# Altium schematic sheet BUCK.SchDoc
size A4; SheetNumber: 2; SheetTotal: 3
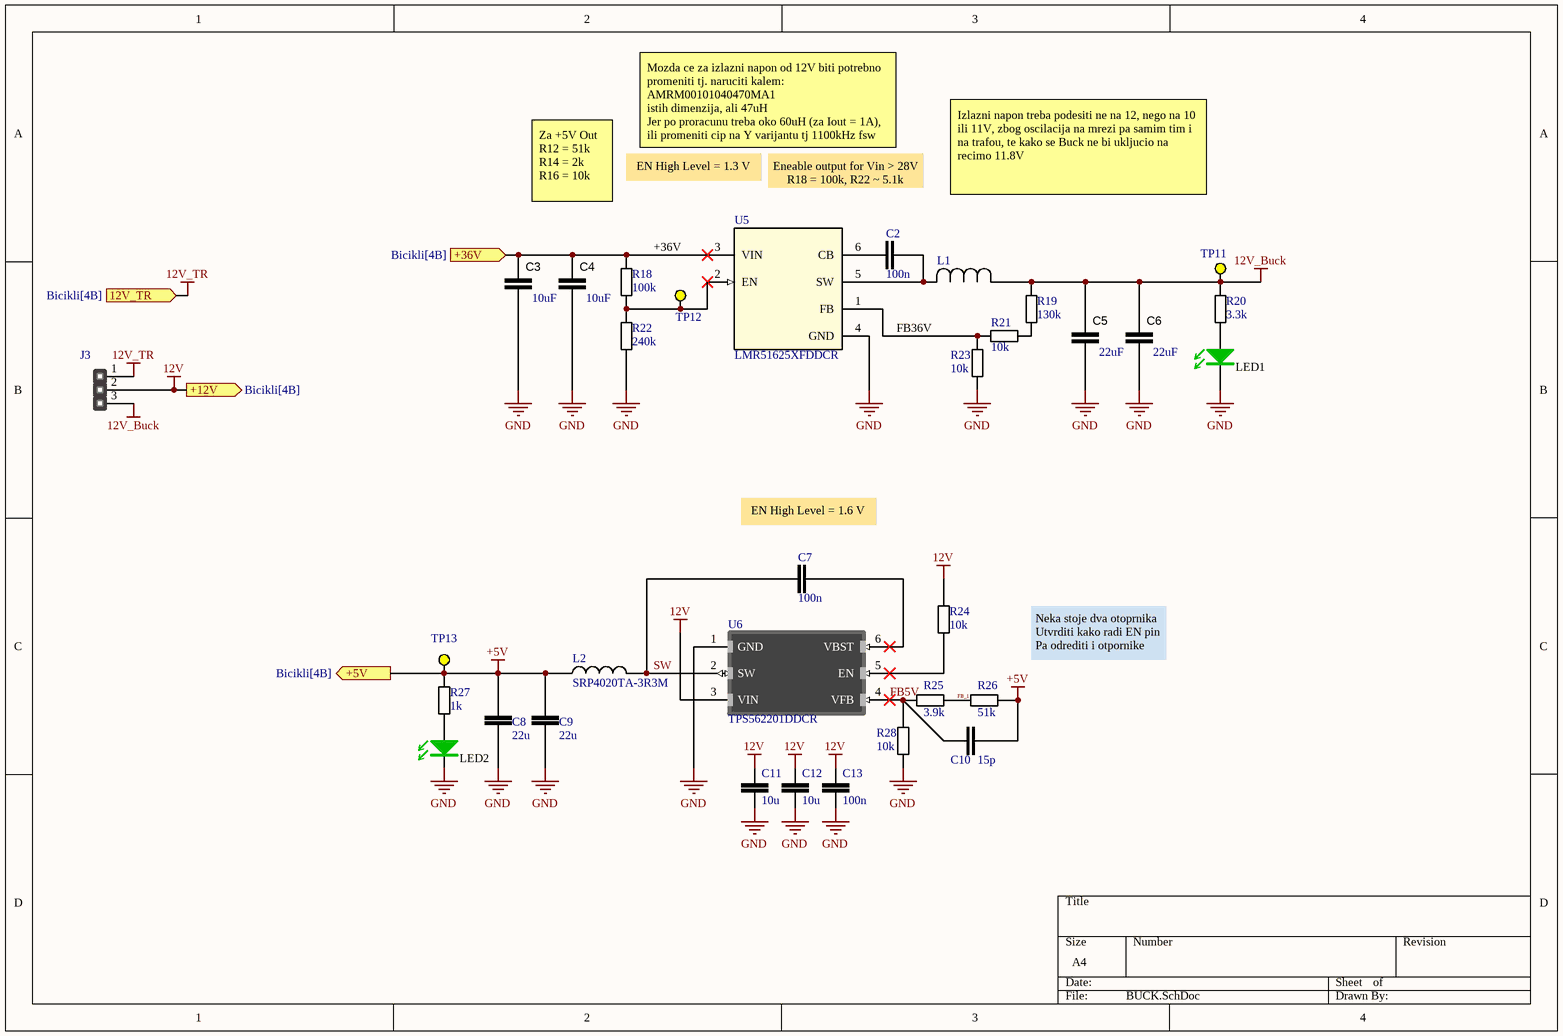
[diagram p0: BUCK.SchDoc]

## Parts
C2  100n  [CAP_0805]
C3  10uF  [CAP_1206]
C4  10uF  [CAP_1206]
C5  22uF  [CAP_1206]
C6  22uF  [CAP_1206]
C7  100n  [CAP_0805]
C8  22u  [CAP_0805]
C9  22u  [CAP_0805]
C10  15p  [CAP_0805]
C11  10u  [CAP_1206]
C12  10u  [CAP_1206]
C13  100n  [CAP_0805]
J3  3Pin  [HEADER3PIN]  (value not drawn)
L1  AMRM00101040100MA1  [IND_AMRM00101040_PUL]  (value not drawn)
L2  SRP4020TA-3R3M  [IND_SRP4020TA-3R3M]
LED1  LED GREEN  [LED_GREEN_0805]  (value not drawn)
LED2  LED GREEN  [LED_GREEN_0805]  (value not drawn)
R18  100k  [RESISTOR_0805_SMALLSILK]
R19  130k  [RESISTOR_0805_SMALLSILK]
R20  3.3k  [RESISTOR_0805_SMALLSILK]
R21  10k  [RESISTOR_0805_SMALLSILK]
R22  240k  [RESISTOR_0805_SMALLSILK]
R23  10k  [RESISTOR_0805_SMALLSILK]
R24  10k  [RESISTOR_0805_SMALLSILK]
R25  3.9k  [RESISTOR_0805_SMALLSILK]
R26  51k  [RESISTOR_0805_SMALLSILK]
R27  1k  [RESISTOR_0805_SMALLSILK]
R28  10k  [RESISTOR_0805_SMALLSILK]
TP11  TP  [TP]  (value not drawn)
TP12  TP  [TP]  (value not drawn)
TP13  TP  [TP]  (value not drawn)
U5  LMR51625XFDDCR  [DDC0006A-MFG]
U6  TPS562201DDCR  [SOT95P280X110-6N]

## Ports
12V_TR (in, see Bicikli[4B]), +5V (out, see Bicikli[4B]), +12V (out, see Bicikli[4B]), +36V (in, see Bicikli[4B])

## Nets
12V: C11.2 C12.2 C13.2 J3.2 R24.2 U6.3(VIN) ; port +12V
12V_Buck: C5.2 C6.2 J3.3 L1.1 R19.2 R20.2 TP11.1
12V_TR: J3.1 ; port 12V_TR
+5V: C8.2 C9.2 C10.2 L2.1 R26.2 R27.2 TP13.1 ; port +5V
GND: C3.1 C4.1 C5.1 C6.1 C8.1 C9.1 C11.1 C12.1 C13.1 LED1.1(C) LED2.1(C) R22.1 R23.1 R28.1 U5.4(GND) U6.1(GND)
+36V: C3.2 C4.2 R18.2 U5.3(VIN) ; port +36V
FB5V: C10.1 R25.1 R28.2 U6.4(VFB)
FB36V: R21.2 R23.2 U5.1(FB)
FB_1: R25.2 R26.1
SW: C7.1 L2.2 U6.2(SW)
NetC2_1: C2.1 U5.6(CB)
NetC2_2: C2.2 L1.2 U5.5(SW)
NetC7_2: C7.2 U6.6(VBST)
NetLED1_2: LED1.2(A) R20.1
NetLED2_2: LED2.2(A) R27.1
NetR18_1: R18.1 R22.2 TP12.1 U5.2(EN)
NetR19_1: R19.1 R21.1
NetR24_1: R24.1 U6.5(EN)

## Notes on the sheet
- EN High Level = 1.3 V
- Mozda ce za izlazni napon od 12V biti potrebno promeniti tj. naruciti kalem:
  AMRM00101040470MA1
  istih dimenzija, ali 47uH
  Jer po proracunu treba oko 60uH (za Iout = 1A), ili promeniti cip na Y varijantu tj 1100kHz fsw
- Za +5V Out
  R12 = 51k
  R14 = 2k
  R16 = 10k
- Eneable output for Vin > 28V
  R18 = 100k, R22 ~ 5.1k
- Izlazni napon treba podesiti ne na 12, nego na 10 ili 11V, zbog oscilacija na mrezi pa samim tim i na trafou, te kako se Buck ne bi ukljucio na recimo 11.8V
- EN High Level = 1.6 V
- (near R26) Neka stoje dva otoprnika
  Utvrditi kako radi EN pin
  Pa odrediti i otpornike

## Library data of the parts
C2 C7 C13 = C00079: CAP 100nF ±10% 50V 0805 X7R; capacitance: 100n
C3 C4 = C000020: 10 µF ±10% 50V Ceramic Capacitor X7R 1206 (3216 Metric); capacitance: 22uF; ComponentLink1Description: DigiKey; ComponentLink1URL: https://www.digikey.com/en/products/detail/samsung-electro-mechanics/CL31A226KAHNNNE/3888705; DigiKey Part Number: 1276-3047-1-ND
C5 C6 = C000020: 22 µF ±10% 25V Ceramic Capacitor X5R 1206 (3216 Metric); capacitance: 22uF; ComponentLink1Description: DigiKey; ComponentLink1URL: https://www.digikey.com/en/products/detail/samsung-electro-mechanics/CL31A226KAHNNNE/3888705; DigiKey Part Number: 1276-3047-1-ND
C8 C9 = C00086: CAP 22uF ±20% 10V 0805 X5R; capacitance: 22u
C10 = C00026: CAP 15pF ±5% 50V 0805 C0G; capacitance: 15p
C11 C12 = C00084: CAP 10uF ±10% 25V 0805 X5R; capacitance: 4.7u
J3 = HEADER3PIN: 3 PIN Male Header 2.54mm pitch
L1 = AMRM00101040100MA1: No Description Available; Manufacturer_Name: Pulse Electronics Corporation; Type: Fixed Inductors; Copyright: Copyright (C) 2025 Ultra Librarian. All rights reserved.; Manufacturer_Part_Number: AMRM00101040100MA1
L2 = SRP4020TA-3R3M: Surface Mount Power Inductor, AEC-Q200 SRP4020TA Series, 15 H, 20%, Shielded, 0.374 ohm, 1.5 A; MF: {'manufacturer': u'Bourns'}; Package: None; Price: None; Value: *; MP: SRP4020TA-3R3M; Availability: Unavailable
LED1 LED2 = LED_GREEN 0805: LED GREEN CLEAR 0805 SMD; Manufacturer: Kingbright; Manufacturer Part Number: APT2012SGC; Barcode: 2911010024338; id: 28; Voltage Forward: 2.2V; Wavelength: 568nm; Lens Color: Colorless; item_id: 3342; Recommended Rating: Platinum; Category: Optoelectronics; Assembly: SMD; Datasheet URL: http://www.kingbrightusa.com/images/catalog/SPEC/APT2012SGC.pdf; Package Case: 0805 (2012 Metric); Color: Green; Family: LED; Lens Transparency: Clear; Part Type: Optoelectronics
R18 = R000006: RES  100k OHM 1% 1/8W 0805; resistance: 100k
R19 = R000027: RES  130k OHM 1% 1/8W 0805; resistance: 130k
R20 = R000088: RES  3k3 OHM 1% 1/8W 0805; resistance: 3.3k
R21 R23 R24 R28 = R000005: RES  10k OHM 1% 1/8W 0805; resistance: 10k
R22 = R000069: RES  240k OHM 1% 1/8W 0805; resistance: 240k
R25 = R000102: RES  3k9 OHM 1% 1/8W 0805; resistance: 3.9k
R26 = R000124: RES  51k OHM 1% 1/8W 0805; resistance: 51k
R27 = R000004: RES  1k OHM 1% 1/8W 0805; resistance: 1k
TP11-TP13 = TP: Test Point 1.5mm radius
U5 = LMR51625XFDDCR: SIMPLE SWITCHERÂ® synchronous buck converter with 4.3V-to-60V, 2.5A and low quiescent current 6-SOT-23-THIN -40 to 150; Manufacturer_Name: Texas Instruments; TYPE: TYPE; RefDes: RefDes; Copyright: Copyright (C) 2025 Ultra Librarian. All rights reserved.; Manufacturer_Part_Number: LMR51625XFDDCR; Datasheet: https://www.ti.com/lit/gpn/lmr51625
U6 = TPS562201DDCR: 4.5 V to 17 V input, 2 A output, synchronous step-down converter in Eco-mode 6-SOT-23-THIN -40 to 125; MF: {'manufacturer': u'Texas Instruments'}; Package: None; Price: None; Value: *; MP: TPS562201DDCR; Availability: Unavailable